# EAGLE design wireless-therm-mk1 (EAGLE 6.4)
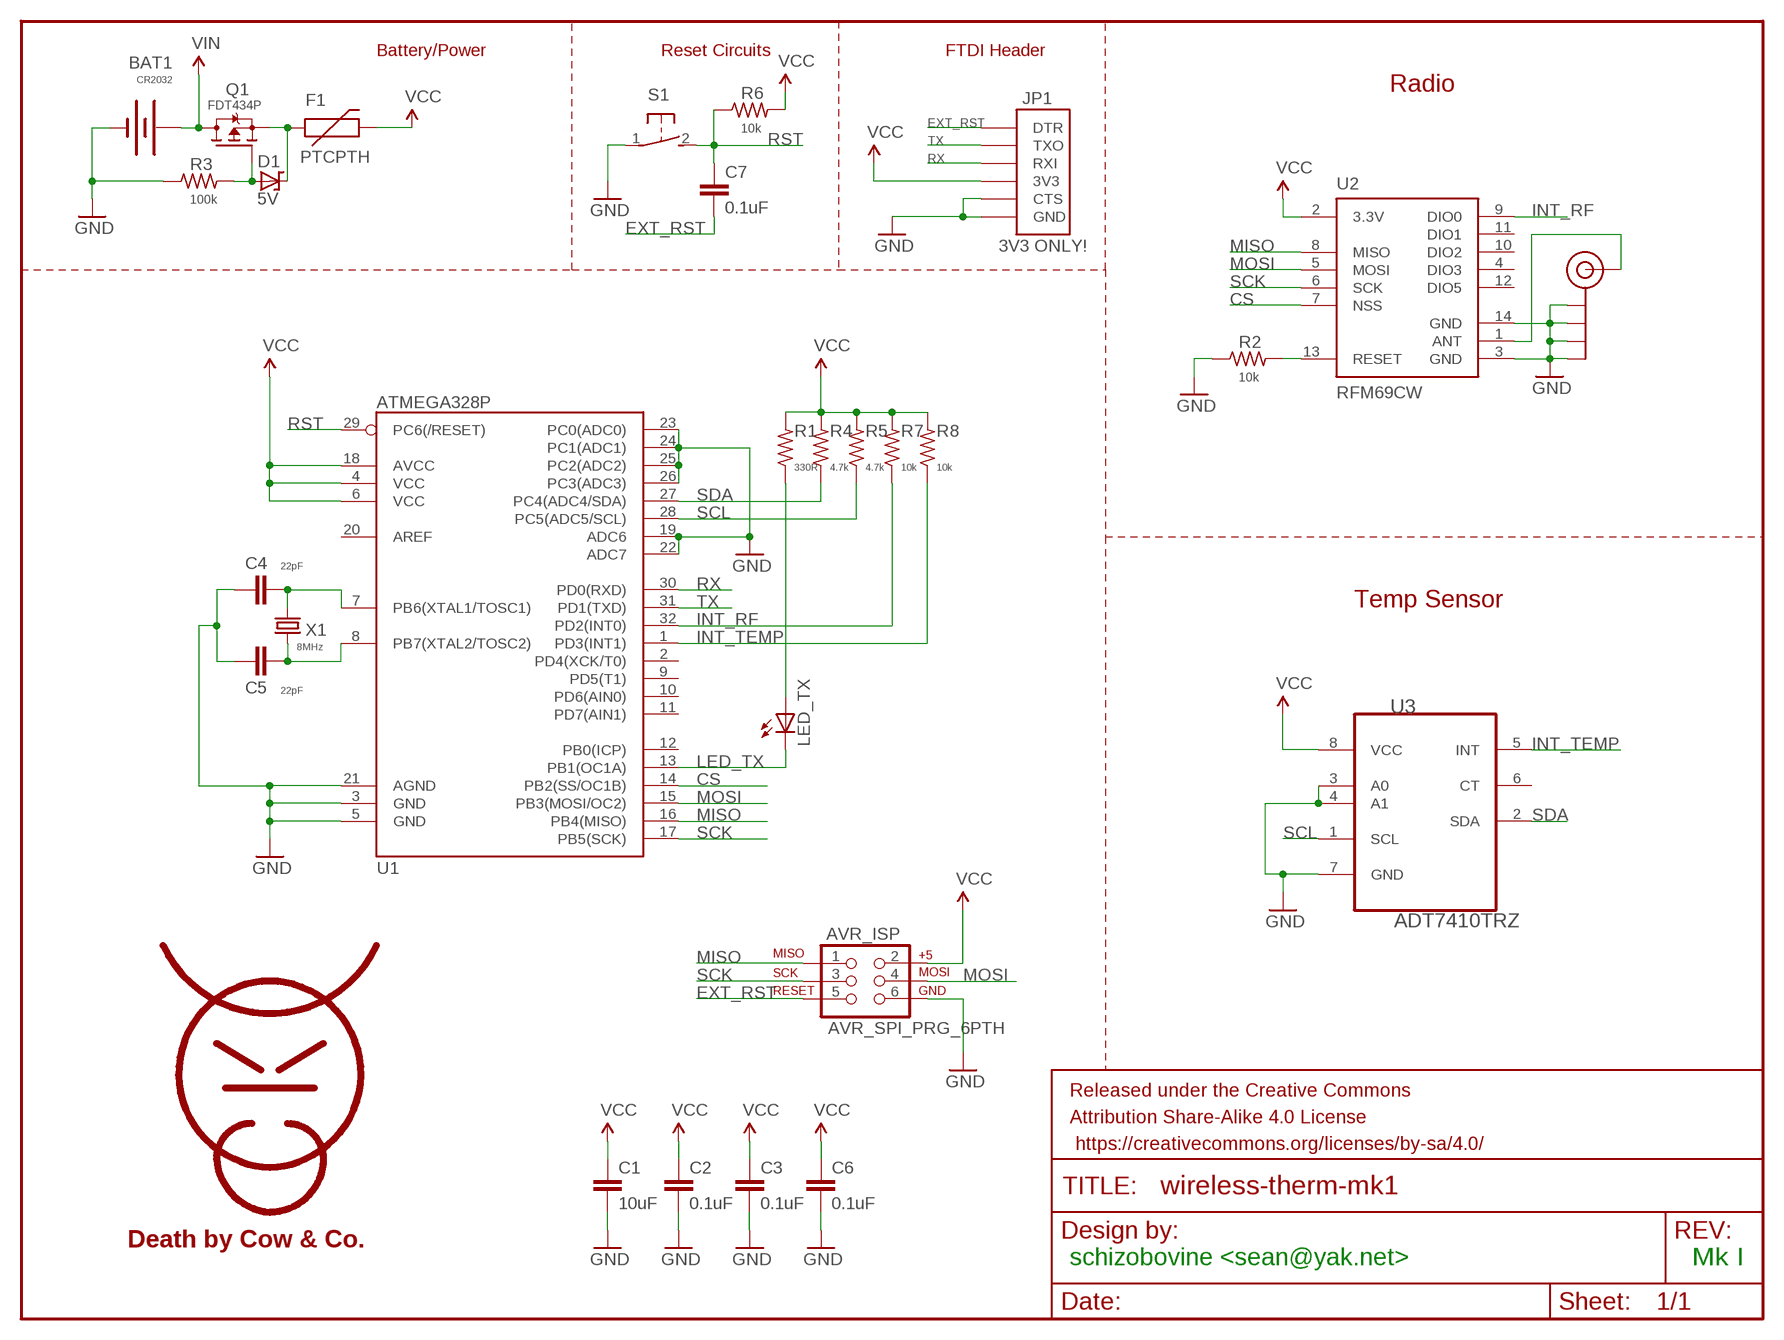
[diagram p0: schematic, sheet 1]

## Parts
AVR_ISP  AVR_SPI_PRG_6PTH  [2X3]
BAT1  CR2032  BATTERY20SMD  [BATTCON_20MM]
C1  10uF  CAPACITOR-CERAMIC050-025X075  [C050-025X075]
C2  0.1uF  CAPACITOR-CERAMIC025-024X044  [C025-024X044]
C3  0.1uF  CAPACITOR-CERAMIC025-024X044  [C025-024X044]
C4  22pF  C-EU025-025X050  [C025-025X050]
C5  22pF  C-EU025-025X050  [C025-025X050]
C6  0.1uF  CAPACITOR-CERAMIC025-024X044  [C025-024X044]
C7  0.1uF  CAPACITOR-CERAMIC025-024X044  [C025-024X044]
D1  5V  DO-34ZDO-34Z  [DO34Z7]
F1  PTCPTH  [PTC]
FRAME1  FRAME-LETTER  [CREATIVE_COMMONS]
JP1  3V3 ONLY!  FTDI_3V3  [FTDI_3V3]
LED_TX  GREEN  LED3MM  [LED3MM]
Q1  FDT434P  [SOT223]
R1  330R  R-US_0204/5  [0204/5]
R2  10k  R-US_0204/5  [0204/5]
R3  100k  R-US_0204/5  [0204/5]
R4  4.7k  R-US_0204/5  [0204/5]
R5  4.7k  R-US_0204/5  [0204/5]
R6  10k  R-US_0204/5  [0204/5]
R7  10k  R-US_0204/5  [0204/5]
R8  10k  R-US_0204/5  [0204/5]
S1  DTS-3  [DTS-3]
SMA_CON  SMA_EDGE  [SMA-EDGE]
U1  ATMEGA328P  ATMEGA328_SMT  [TQFP32-08]
U2  RFM69CW  [RFM69CW-XXXS2]
U3  ADT7410TRZ  [SOIC127P600X175-8N]
U$4  COW  [COW]
X1  8MHz  CRYSTALHC49U70  [HC49U70]

## Nets
ANT: SMA_CON.SIG(SIGNAL) U2.1(ANT)
CS: U1.14(PB2(SS/OC1B)) U2.7(NSS)
EXT_RST: AVR_ISP.5 C7.2 JP1.P$1(DTR)
GND: AVR_ISP.6 BAT1.2(-) C1.2 C2.2 C3.2 C4.1 C5.1 C6.2 JP1.P$5(CTS) JP1.P$6(GND) R2.1 R3.1 S1.1 SMA_CON.GND@0(GND) SMA_CON.GND@1(GND) SMA_CON.GND@2(GND) SMA_CON.GND@3(GND) U1.3(GND) U1.5(GND) U1.19(ADC6) U1.21(AGND) U1.22(ADC7) U1.23(PC0(ADC0)) U1.24(PC1(ADC1)) U1.25(PC2(ADC2)) U1.26(PC3(ADC3)) U2.3(GND) U2.14(GND) U3.3(A0) U3.4(A1) U3.7(GND)
INT_RF: R7.1 U1.32(PD2(INT0)) U2.9(DIO0)
INT_TEMP: R8.1 U1.1(PD3(INT1)) U3.5(INT)
LED_TX: LED_TX.K(C) U1.13(PB1(OC1A))
MISO: AVR_ISP.1 U1.16(PB4(MISO)) U2.8(MISO)
MOSI: AVR_ISP.4 U1.15(PB3(MOSI/OC2)) U2.5(MOSI)
N$1: LED_TX.A R1.1
N$2: R2.2 U2.13(RESET)
N$3: D1.C F1.P$1 Q1.3(S)
N$6: C4.2 U1.7(PB6(XTAL1/TOSC1)) X1.2
N$7: C5.2 U1.8(PB7(XTAL2/TOSC2)) X1.1
N$8: D1.A Q1.1(G) R3.2
RST: C7.1 R6.1 S1.2 U1.29(PC6(/RESET))
RX: JP1.P$3(RXI) U1.30(PD0(RXD))
SCK: AVR_ISP.3 U1.17(PB5(SCK)) U2.6(SCK)
SCL: R5.1 U1.28(PC5(ADC5/SCL)) U3.1(SCL)
SDA: R4.1 U1.27(PC4(ADC4/SDA)) U3.2(SDA)
TX: JP1.P$2(TXO) U1.31(PD1(TXD))
VCC: AVR_ISP.2 C1.1 C2.1 C3.1 C6.1 F1.P$2 JP1.P$4(3V3) R1.2 R4.2 R5.2 R6.2 R7.2 R8.2 U1.4(VCC) U1.6(VCC) U1.18(AVCC) U2.2(3.3V) U3.8(VCC)
VIN: BAT1.1(+) BAT1.3(+) Q1.2(D) Q1.4(D)
Unconnected: U1.2(PD4(XCK/T0)) U1.9(PD5(T1)) U1.10(PD6(AIN0)) U1.11(PD7(AIN1)) U1.12(PB0(ICP)) U1.20(AREF) U2.4(DIO3) U2.10(DIO2) U2.11(DIO1) U2.12(DIO5) U3.6(CT)

## Notes on the sheet
- Battery/Power | Reset Circuits | FTDI Header
- Radio
- Temp Sensor
- schizobovine <sean@yak.net> | Mk I

## Library data of the parts
AVR_ISP = SparkFun-Connectors:AVR_SPI_PRG_6: AVR ISP 6 Pin This is the reduced ISP connector for AVR programming. Common on Arduino. This footprint will take up less PCB space and can be used with a 10-pin to 6-pin adapter such as SKU: BOB-08508 **Special note about "TEST_POINT" package. The stop mask is on the top side, so if you want your programming test points to be on the bottom of your board, make sure to place this package on the bottom side of the board. This also ensure that the orientation to program from the bottom side will be correct.
BAT1 = butts:BATTERY: Battery Holders Various common sizes : AA, AAA, 20mm coin cell and 12mm coin cell. 20MM_4LEGS, BATT-10373
C1-C3 C6 C7 = butts:CAPACITOR-CERAMIC: CAPACITOR, European symbol
C4 C5 = rcl:C-EU: CAPACITOR, European symbol
D1 = butts:DO-34Z: Z DIODE
F1 = SparkFun-PowerIC:PTC: Resettable Fuse PTC Resettable Fuse. Spark Fun Electronics SKU : COM-08357
FRAME1 = SparkFun-Aesthetics:FRAME-LETTER: Schematic Frame Standard 8.5x11 US Letter frame
JP1 = butts:FTDI_3V3: Connector which mates to FTDI basic or FTDI cable.
LED_TX = led:LED: LED OSRAM: - CHIPLED LG R971, LG N971, LY N971, LG Q971, LY Q971, LO R971, LY R971 LH N974, LH R974 LS Q976, LO Q976, LY Q976 LO Q996 - Hyper CHIPLED LW Q18S LB Q993, LB Q99A, LB R99A - SideLED LS A670, LO A670, LY A670, LG A670, LP A670 LB A673, LV A673, LT A673, LW A673 LH A674 LY A675 LS A676, LA A676, LO A676, LY A676, LW A676 LS A679, LY A679, LG A679 - Hyper Micro SIDELED® LS Y876, LA Y876, LO Y876, LY Y876 LT Y87S - SmartLED LW L88C, LW L88S LB L89C, LB L89S, LG L890 LS L89K, LO L89K, LY L89K LS L896, LA L896, LO L896, LY L896 - TOPLED LS T670, LO T670, LY T670, LG T670, LP T670 LSG T670, LSP T670, LSY T670, LOP T670, LYG T670 LG T671, LOG T671, LSG T671 LB T673, LV T673, LT T673, LW T673 LH T674 LS T676, LA T676, LO T676, LY T676, LB T676, LH T676, LSB T676, LW T676 LB T67C, LV T67C, LT T67C, LS T67K, LO T67K, LY T67K, LW E67C LS E67B, LA E67B, LO E67B, LY E67B, LB E67C, LV E67C, LT E67C LW T67C LS T679, LY T679, LG T679 LS T770, LO T770, LY T770, LG T770, LP T770 LB T773, LV T773, LT T773, LW T773 LH T774 LS E675, LA E675, LY E675, LS T675 LS T776, LA T776, LO T776, LY T776, LB T776 LHGB T686 LT T68C, LB T68C - Hyper Mini TOPLED® LB M676 - Mini TOPLED Santana® LG M470 LS M47K, LO M47K, LY M47K Source: http://www.osram.convergy.de LUXEON: - LUMILED® LXK2-PW12-R00, LXK2-PW12-S00, LXK2-PW14-U00, LXK2-PW14-V00 LXK2-PM12-R00, LXK2-PM12-S00, LXK2-PM14-U00 LXK2-PE12-Q00, LXK2-PE12-R00, LXK2-PE12-S00, LXK2-PE14-T00, LXK2-PE14-U00 LXK2-PB12-K00, LXK2-PB12-L00, LXK2-PB12-M00, LXK2-PB14-N00, LXK2-PB14-P00, LXK2-PB14-Q00 LXK2-PR12-L00, LXK2-PR12-M00, LXK2-PR14-Q00, LXK2-PR14-R00 LXK2-PD12-Q00, LXK2-PD12-R00, LXK2-PD12-S00 LXK2-PH12-R00, LXK2-PH12-S00 LXK2-PL12-P00, LXK2-PL12-Q00, LXK2-PL12-R00 Source: www.luxeon.com KINGBRIGHT: KA-3528ASYC Source: www.kingbright.com
Q1 = butts:FDT434P: Fairchild Semiconductor P-Channel 2.5V Specified PowerTrench® MOSFET Rds (on) = 0.05Ω @ -4.5V Rds (on) = 0.07Ω @ -2.5V Vds (max) = -20V Vgs (max) = +/-8V Vgs (threshhold) = -0.6V (typical), -1V (max) Pd = 1.1W (with minimal surface pads as in this part)
R1-R8 = rcl:R-US_: RESISTOR, American symbol
S1 = switch-tact:DTS-3
SMA_CON = SparkFun-Connectors:SMA_EDGE: SMA Antenna Connector End launch SMA connector. The paste layer has been removed so that the connector can be hand soldered onto the board after reflow.
U1 = SparkFun-DigitalIC:ATMEGA328_SMT: 32-Pin Atmega328 part Commonly used on Arduino compatible boards Available in QFP and QFN packages TQFP is IC-09069 QFN is non-stock; PROD_ID: IC-09069
U2 = butts:RFM69
U3 = butts:ADT7410TRZ: I2C Temperature Sensor; MPN: ADT7410TRZ; OC_FARNELL: 2102534; OC_NEWARK: 08R6646; PACKAGE: SOIC-8; SUPPLIER: ANALOG DEVICES
U$4 = butts:COW
X1 = crystal:CRYSTAL: CRYSTAL; OC_FARNELL: unknown; OC_NEWARK: unknown

## Board
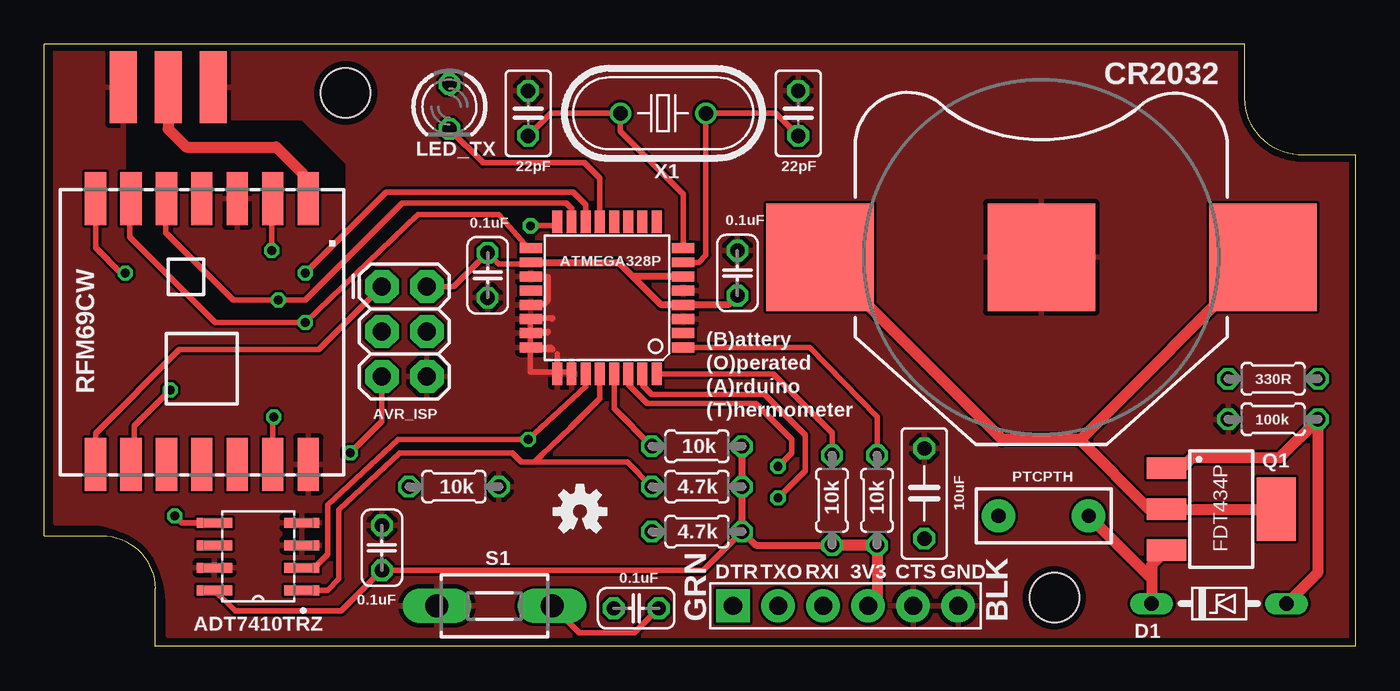
[diagram p1: board, top side]
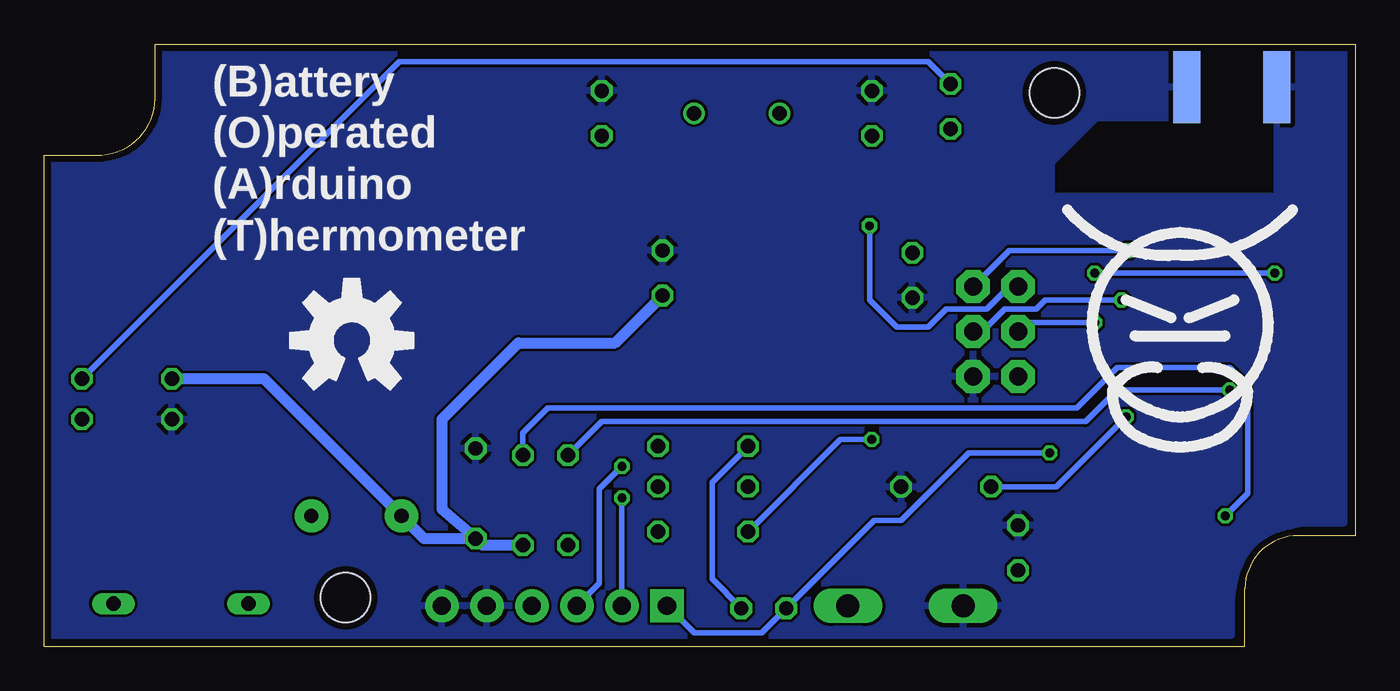
[diagram p2: board, bottom side, seen from below]

Size 74 x 34 mm. Coordinates in mm from the lower left corner, seen from the top.
Outline: 74,0 74,27.75 70.75,27.75 arc-90 67.75,31.25 67.75,34 0,34 0,6.25 3.25,6.25 arc-90 6.25,3.25 6.25,0 74,0
Copper layers (1*16): Top 0.0356mm / dielectric 1.5011mm / Bottom 0.0356mm
Design rules "LaenPCBOrder *": minimum track width 6mil, minimum drill 13mil, track to track 6mil, track to pad 6mil, pad to pad 6mil, via to via 6mil, smd to smd 6mil, copper to edge 15mil, drill to drill 6mil, minimum pad ring 7mil, minimum via ring 7mil, stop-mask expansion 3mil, vias tented up to drill 20mil, thermal gap 10mil
Holes 2.8 mm at 17,31.25 57,2.75

### Footprints (pad centres in the part's own frame; a part is rotated, then mirrored left to right if it is on the bottom)
2X3 = drill 1.016 pad 1.88 octagon: 1 0,0; 2 0,2.54; 3 2.54,0; 4 2.54,2.54; 5 5.08,0; 6 5.08,2.54
BATTCON_20MM = smd 6.07 x 6.07: 1 -12.5,0; 2 0,0; 3 12.5,0
C050-025X075 = drill 0.813 octagon: 1 -2.54,0; 2 2.54,0
C025-024X044 = drill 0.813 octagon: 1 -1.27,0; 2 1.27,0
C025-025X050 = drill 0.813 octagon: 1 -1.27,0; 2 1.27,0
DO34Z7 = drill 0.813 long: A -3.81,0; C 3.81,0
PTC = drill 0.8 pad 1.88: P$1 -2.54,0; P$2 2.54,0
FTDI_3V3 = drill 1.016 pad 1.88 square: P$1 -6.35,0 | drill 1.016 pad 1.88: P$2 -3.81,0; P$3 -1.27,0; P$4 1.27,0; P$5 3.81,0; P$6 6.35,0
LED3MM = drill 0.813 octagon: A -1.27,0; K 1.27,0
SOT223 = smd 1.219 x 2.235: 1 -2.311,-3.099; 2 0,-3.099; 3 2.311,-3.099 | smd 3.6 x 2.2: 4 0,3.099
0204/5 = drill 0.813 octagon: 1 -2.54,0; 2 2.54,0
DTS-3 = drill 1.3 long: 1 -3.25,0; 2 3.25,0
SMA-EDGE = smd 1.524 x 4.064: GND@0 0,0; GND@1 5.08,0; SIG 2.54,0 | smd 1.524 x 4.064 bottom: GND@2 0,0; GND@3 5.08,0
TQFP32-08 = smd 1.27 x 0.559: 1 -4.293,2.8; 2 -4.293,2; 3 -4.293,1.2; 4 -4.293,0.4; 5 -4.293,-0.4; 6 -4.293,-1.2; 7 -4.293,-2; 8 -4.293,-2.8; 17 4.293,-2.8; 18 4.293,-2; 19 4.293,-1.2; 20 4.293,-0.4; 21 4.293,0.4; 22 4.293,1.2; 23 4.293,2; 24 4.293,2.8 | smd 0.559 x 1.27: 9 -2.8,-4.293; 10 -2,-4.293; 11 -1.2,-4.293; 12 -0.4,-4.293; 13 0.4,-4.293; 14 1.2,-4.293; 15 2,-4.293; 16 2.8,-4.293; 25 2.8,4.293; 26 2,4.293; 27 1.2,4.293; 28 0.4,4.293; 29 -0.4,4.293; 30 -1.2,4.293; 31 -2,4.293; 32 -2.8,4.293
RFM69CW-XXXS2 = smd 3 x 1.2: 1 -7.5,6; 2 -7.5,4; 3 -7.5,2; 4 -7.5,0; 5 -7.5,-2; 6 -7.5,-4; 7 -7.5,-6; 8 7.5,-6; 9 7.5,-4; 10 7.5,-2; 11 7.5,0; 12 7.5,2; 13 7.5,4; 14 7.5,6
SOIC127P600X175-8N = smd 1.981 x 0.559: 1 -2.464,1.905; 2 -2.464,0.635; 3 -2.464,-0.635; 4 -2.464,-1.905; 5 2.464,-1.905; 6 2.464,-0.635; 7 2.464,0.635; 8 2.464,1.905
HC49U70 = drill 0.813: 1 -2.413,0; 2 2.413,0

### Placement (x,y rotation side)
AVR_ISP  19.05,20.32 270 top
BAT1  56.26,21.97 0 top
C1  49.66,8.64 90 top
C2  19.05,5.57 90 top
C3  25.02,20.95 270 top
C4  42.55,30.1 270 top
C5  27.3,30.1 270 top
C6  39.12,21.08 90 top
C7  33.4,2.15 180 top
D1  66.29,2.41 180 top
F1  56.39,7.37 180 top
FRAME1  15.37,40.39 0 top  (outside the outline)
JP1  45.21,2.29 0 top
LED_TX  22.86,30.48 270 top
LOGO1  OSHW-LOGOS  [OSHW-LOGO-S]  30.23,7.62 0 top
Q1  66.42,7.75 270 top
R1  69.34,15.11 180 top
R2  23.11,9.02 180 top
R3  69.34,12.83 0 top
R4  36.83,6.48 0 top
R5  36.83,9.02 0 top
R6  36.83,11.3 0 top
R7  44.45,8.26 270 top
R8  46.99,8.26 270 top
S1  25.4,2.29 0 top
SMA_CON  4.45,31.57 0 top
U1  31.75,19.68 180 top
U2  8.89,17.78 270 top
U3  12.06,5.08 180 top
U$3  [OSHW-LOGO-L]  56.64,17.27 0 bottom
U$4  9.91,17.02 0 bottom
X1  34.92,30.1 0 top

### Tracks (layer width: path | path; a pad name or v marks a point on that pad's centre or on a via)
ANT
  Top 0.61: SMA_CON.SIG 6.99,29.21 8,28.19 13.08,28.19 14.61,26.67 14.61,25.57 U2.1
CS  (via drill 0.5)
  Top 0.305: U2.7 2.89,22.51 4.32,21.08 v4.57,21.08 | U1.14 30.55,24.95 29.84,25.65 19.3,25.65 v14.73,21.08
  Bottom 0.305: v4.57,21.08 v14.73,21.08
EXT_RST  (via drill 0.5)
  Top 0.305: AVR_ISP.5 19.05,12.7 v17.27,10.92
  Bottom 0.305: JP1.P$1 37.34,0.76 33.52,0.76 C7.2 27.17,7.11 25.65,7.11 21.84,10.92 v17.27,10.92
GND
  Top 0.305: 28.39,20.89 28.45,20.83 28.45,19.56 28.19,19.3 27.48,19.3 U1.21 | 28.64,18.48 28.7,18.54 27.43,18.54 27.43,17.78 | 27.43,17.78 27.43,17.71 | 27.43,17.71 U1.23 28.35,17.68 28.45,17.78 27.43,17.78 | 27.43,17.71 27.43,17.02 | 27.43,17.02 27.43,16.91 | 27.43,16.91 U1.24 28.58,16.89 28.7,16.76 27.69,16.76 27.43,17.02 | 27.43,16.91 27.43,15.49 28.85,15.49 U1.25 28.95,16.5 28.96,16.51 28.96,15.49 29.65,15.49 U1.26
  pour Top: 0.64,33.66 4.45,33.66 4.45,25.4 17.14,25.4 17.14,27.3 14.61,29.84 9.53,29.84 9.53,33.66 67.31,33.66 67.31,30.9 arc90 70.9,27.3 73.66,27.3 73.66,0.64 6.99,0.64 6.99,2.49 arc90 2.49,6.99 0.64,6.99
  pour Bottom: 0.64,33.66 4.45,33.66 4.45,25.4 17.14,25.4 17.14,27.3 14.61,29.84 9.53,29.84 9.53,33.66 67.31,33.66 67.31,30.9 arc90 70.9,27.3 73.66,27.3 73.66,0.64 6.99,0.64 6.99,2.49 arc90 2.49,6.99 0.64,6.99
INT_RF  (via drill 0.5)
  Top 0.305: R7.1 44.45,12.06 41.12,15.39 U1.32 | U2.9 5.08,10.47 5.08,12.45 v7.11,14.48
  Bottom 0.305: v7.11,14.48 13.46,14.48 15.24,12.7 42.55,12.7 R7.1
INT_TEMP  (via drill 0.5)
  Top 0.305: U1.1 43.19,16.89 46.99,12.95 R8.1 | v7.37,7.37 7.75,6.99 U3.5
  Bottom 0.305: v7.37,7.37 6.1,8.64 6.1,14.73 7.11,15.75 13.46,15.75 15.75,13.46 45.59,13.46 46.99,12.06 R8.1
LED_TX
  Top 0.305: U1.13 31.35,26.43 30.48,27.3 24.77,27.3 LED_TX.K
MISO  (via drill 0.5)
  Top 0.305: v27.43,23.75 28.72,23.75 U1.16 | U2.8 2.89,12.03 7.62,16.76 15.49,16.76 AVR_ISP.1
  Bottom 0.305: AVR_ISP.1 19.56,20.32 20.83,19.05 23.11,19.05 24.13,18.03 25.91,18.03 27.43,19.56 v27.43,23.75
MOSI  (via drill 0.5)
  Top 0.305: U1.15 29.75,24.73 29.46,25.02 20.19,25.02 14.73,19.56 v13.21,19.56 10.67,19.56 6.86,23.37 6.86,25.25 U2.5
  Bottom 0.305: v13.21,19.56 17.53,19.56 18.03,19.05 19.81,19.05 21.08,17.78 AVR_ISP.4
N$1
  Bottom 0.305: R1.1 53.98,33.02 24.13,33.02 LED_TX.A
N$2  (via drill 0.5)
  Top 0.305: U2.13 12.89,12.89 v12.95,12.95
  Bottom 0.305: R2.2 16.89,9.02 v12.95,12.95
N$3
  Top 0.61: F1.P$1 62.48,3.81 D1.C 62.48,4.6 Q1.3
N$6
  Top 0.305: 36.14,21.59 U1.7 36.92,21.68 37.34,22.1 X1.2 41.27,30.1 C4.2 42.29,29.08
N$7
  Top 0.305: 36.2,22.64 U1.8 36.04,25.55 32.51,29.08 X1.1 28.57,30.1 C5.2 27.56,29.08
N$8
  Top 0.61: D1.A 71.88,4.19 R3.2 69.72,10.67 64.77,10.67 64.16,10.06 Q1.1
RST
  Top 0.305: U1.29 32.15,13.44 R6.1 | S1.2 30.17,0.76 33.28,0.76 C7.1
  Bottom 0.305: C7.1 36.32,3.8 36.32,9.27 R6.1
RX  (via drill 0.5)
  Top 0.305: v41.4,10.16 42.16,10.92 42.16,11.68 40.13,13.72 34.04,13.72 32.95,14.8 U1.30
  Bottom 0.305: JP1.P$3 42.67,3.56 42.67,8.89 v41.4,10.16
SCK  (via drill 0.5)
  Top 0.305: U1.17 27.3,22.48 25.65,24.38 21.08,24.38 v14.73,18.29 9.65,18.29 4.83,23.11 4.83,25.22 U2.6
  Bottom 0.305: AVR_ISP.3 18.54,18.29 v14.73,18.29
SCL
  Top 0.305: U1.28 31.35,13.99 29.68,12.33 28.07,10.8 27.69,10.41 | U3.1 15.99,3.17 16.62,3.8 16.62,7.7 20.07,10.92 26.42,10.92 26.92,10.41 27.43,10.41 27.69,10.41 | R5.1 32.89,10.41 27.69,10.41
SDA  (via drill 0.5)
  Top 0.305: U3.2 15.24,4.45 16,5.21 16,8 19.98,11.68 v27.3,11.68 30.55,14.68 U1.27
  Bottom 0.305: v27.3,11.68 29.08,11.68 R4.1
TX  (via drill 0.5)
  Top 0.305: 33.66,15.3 U1.31 33.78,15.36 33.78,14.73 34.29,14.22 40.64,14.22 42.93,11.94 42.93,9.91 v41.4,8.38
  Bottom 0.305: JP1.P$2 v41.4,8.38
VCC  (via drill 0.5)
  Top 0.305: U3.8 10.78,2 16.76,2 C2.1 37.19,4.29 R4.2 | U1.18 27.36,21.59 25.65,21.59 C3.1 23.11,20.32 AVR_ISP.2 | v12.83,22.35 12.83,25.22 U2.2
  Top 0.406: R6.2 R5.2 R4.2 40.13,5.71 R7.2 | U1.4 35.8,19.29 | U1.18 32.42,21.68 33.27,20.83 | C6.1 38.59,19.29 U1.4 | U1.4 34.82,19.29 33.27,20.83 | U1.6 33.33,20.89 33.27,20.83
  Top 0.61: R7.2 R8.2 46.99,2.79 JP1.P$4
  Bottom 0.305: v12.83,22.35 19.56,22.35 AVR_ISP.2
  Bottom 0.61: C1.1 51.56,7.75 51.56,12.83 47.24,17.14 41.78,17.14 C6.1 | R8.2 49.28,5.71 C1.1 | R1.2 61.59,15.11 F1.P$2 52.58,6.1 C1.1
VIN
  Top 0.61: Q1.4 Q1.2 62.36,7.75 58.42,11.68 | BAT1.3 58.47,11.68 58.42,11.68 | BAT1.1 54.05,11.68 58.42,11.68

### Text on the board
tPlace: (B)attery / (O)perated / (A)rduino / (T)hermometer
bPlace: (B)attery / (O)perated / (A)rduino / (T)hermometer
Reference: schizobovine <sean@yak.net>